# EasyEDA schematic SCH_Motor-Driver-Pcb_2024-06-14.json
TITLE: Sheet_1; REV: 1.0; Date: 2024-01-08; Sheet: 1/1; Drawn By: ee22b045; Company: Your Company
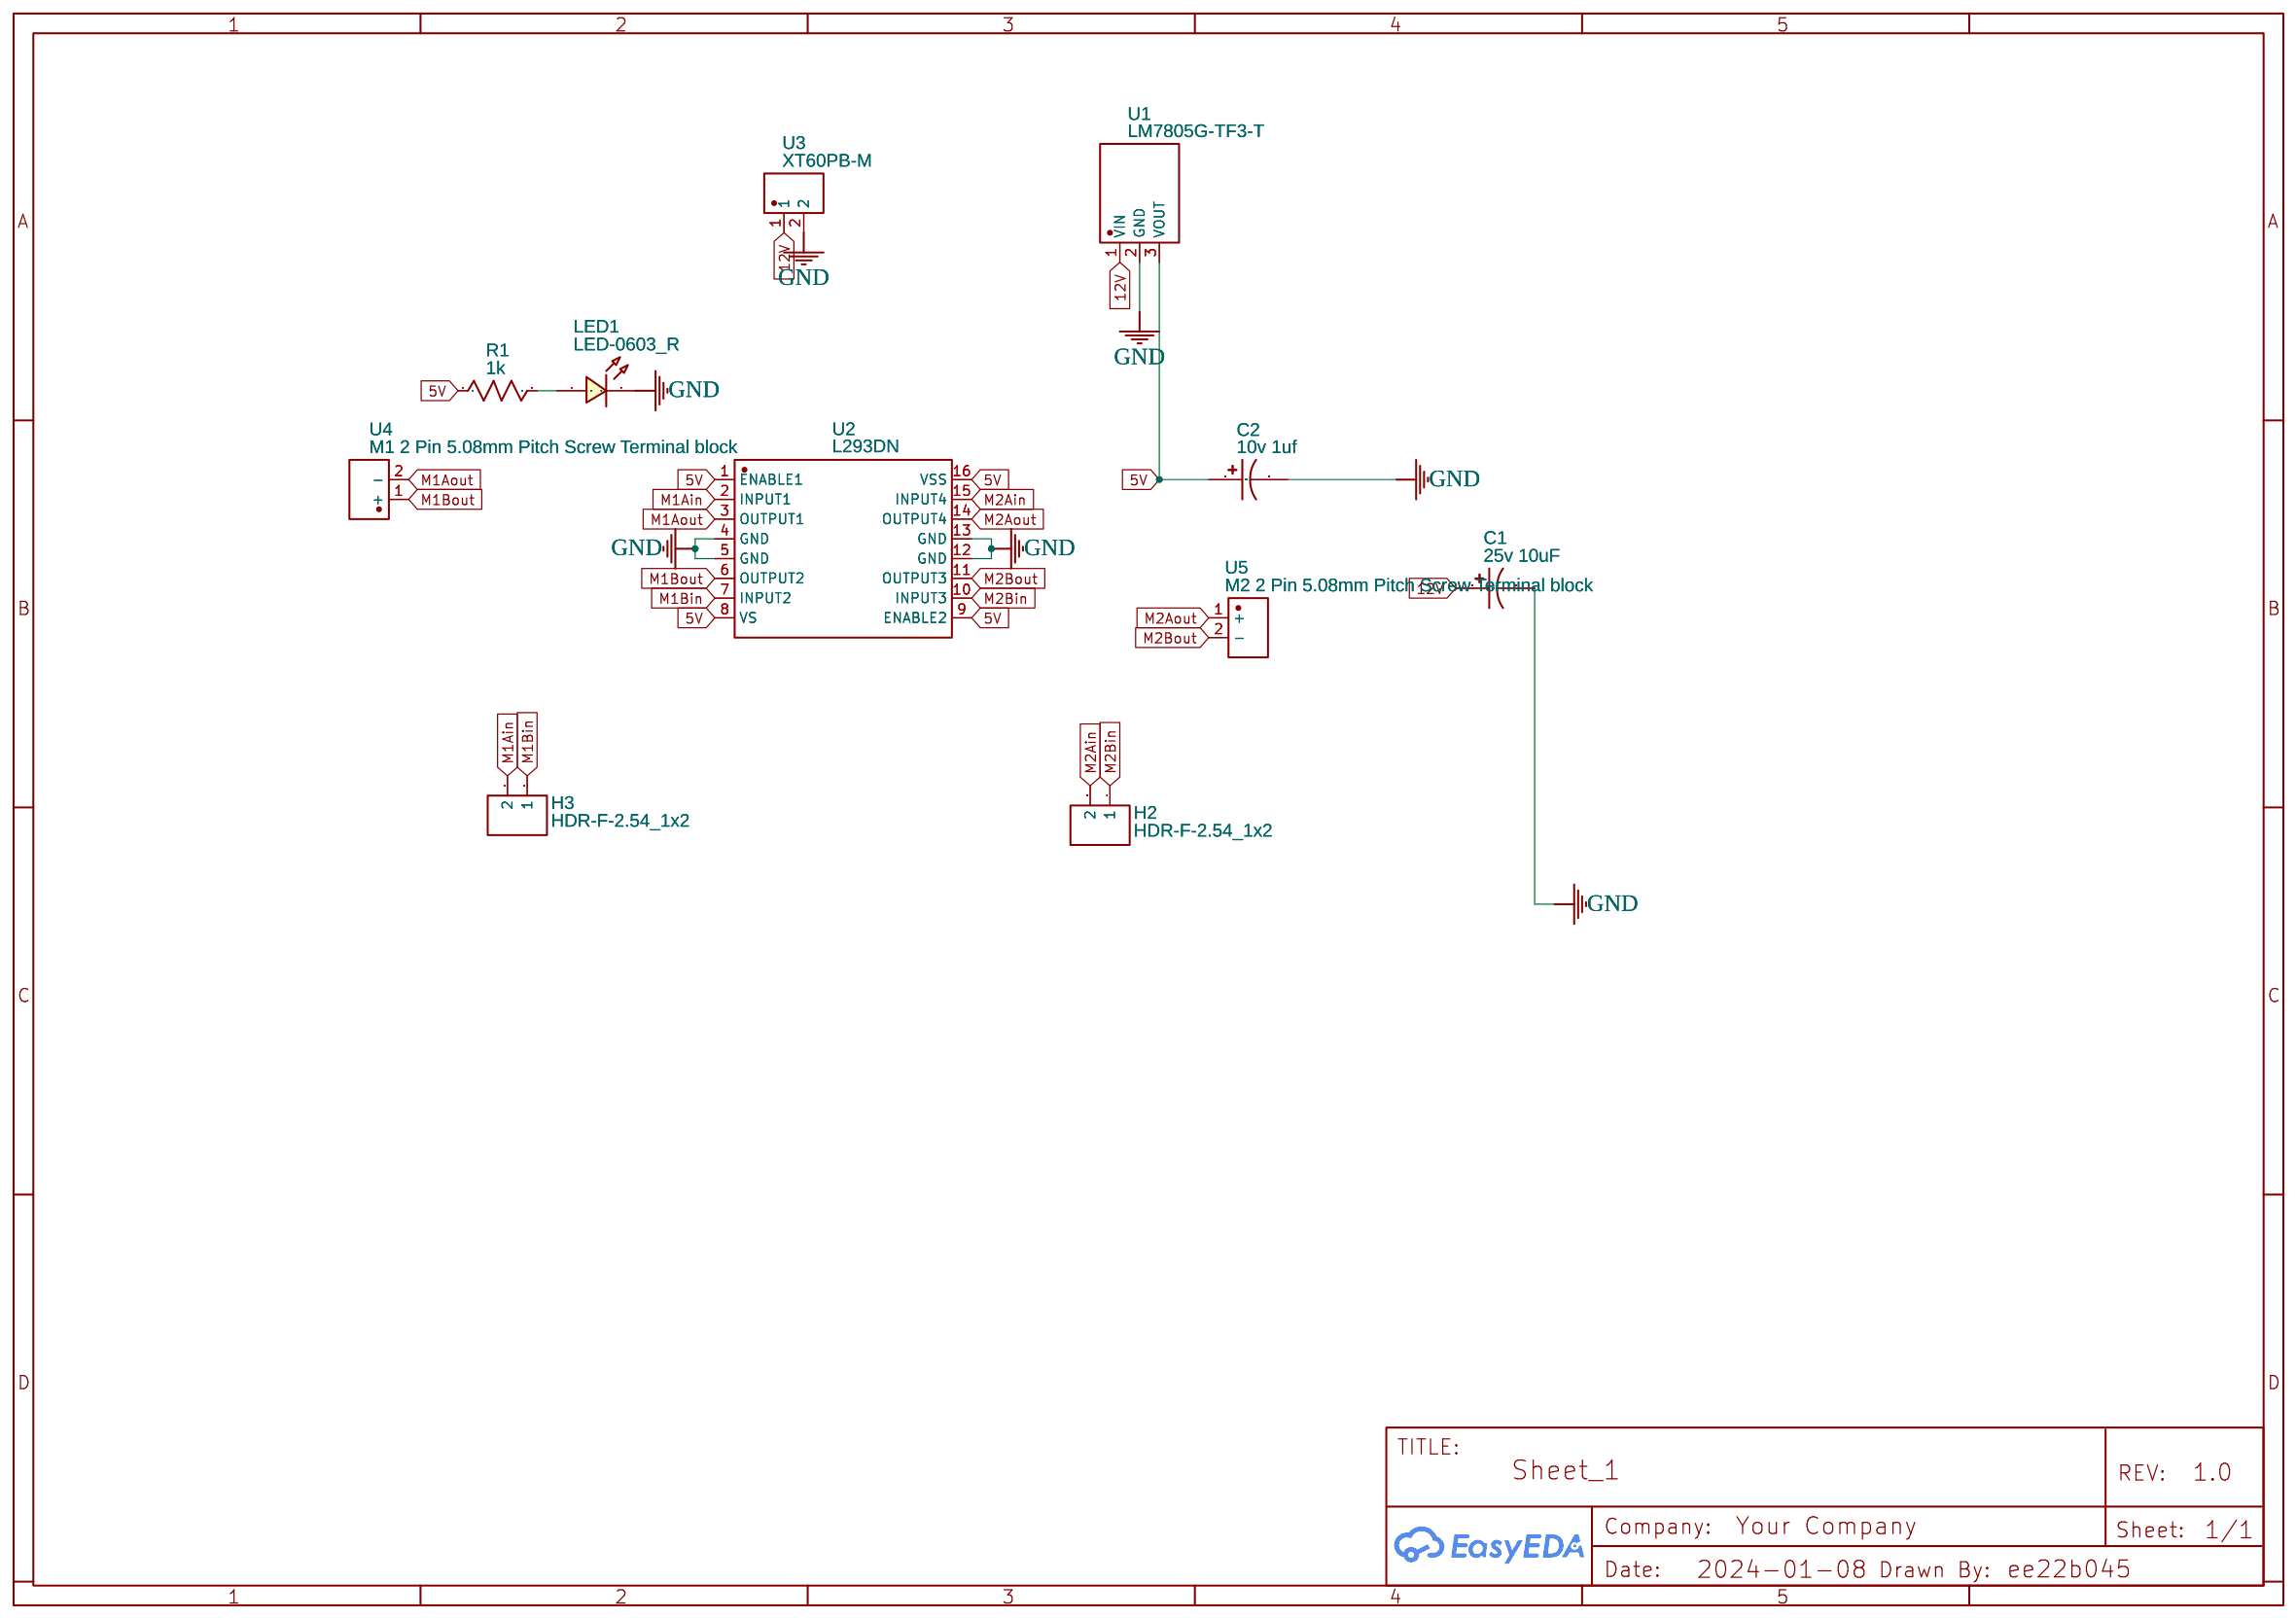
[diagram p0: schematic sheet]

## Parts
C1  25v 10uF  [CASE-A_3216]
C2  10v 1uf  [CASE-A_3216]
H2  HDR-F-2.54_1x2  [HDR-F-2.54_1X2]
H3  HDR-F-2.54_1x2  [HDR-F-2.54_1X2]
LED1  LED-0603_R  [LED0603_RED]
R1  1k  [R0603]
U1  LM7805G-TF3-T  [TO-220F-3_L10.2-W4.7-P2.54-L]
U2  L293DN  [DIP-16_L19.2-W6.6-P2.54-LS7.6-BL]
U3  XT60PB-M  [CONN-TH_XT60PB-M]
U4  M1 2 Pin 5.08mm Pitch Screw Terminal block  [2 PIN 5.08MM PITCH SCREW NEW]
U5  M2 2 Pin 5.08mm Pitch Screw Terminal block  [2 PIN 5.08MM PITCH SCREW NEW]

## Library data of the parts
C1 C2 = C_Tan_SMD_A_US: Contributor: LCEDA_Lib
H2 H3 = HDR-F-2.54_1x2: Supplier Part: C49661; Supplier: LCSC; Contributor: LCEDA_Lib
LED1 = LED-0603_R: Manufacturer: EVERLIGHT(台湾亿光); Manufacturer Part: 19-217/R6C-AL1M2VY/3T; Supplier Part: C72044; Supplier: LCSC; Contributor: LCEDA_01
R1 = R_0603_US: Contributor: LCEDA_Lib
U1 = LM7805G-TF3-T: Contributor: LCSC; Supplier: LCSC; Supplier Part: C213490; Manufacturer: UTC(友顺); JLCPCB Part Class: Extended Part
U2 = L293DN: Contributor: LCSC; Supplier: LCSC; Supplier Part: C434590; Manufacturer: HGSEMI; JLCPCB Part Class: Extended Part
U3 = XT60PB-M: Contributor: lcsc; Supplier: LCSC; Supplier Part: C9900017179; Manufacturer: null; JLCPCB Part Class: Extended Part
U4 U5 = 2 Pin 5.08mm Pitch Screw Terminal block: Contributor: kavishbalaji

## Nets
5V: C2.1 R1.1 U1.3(VOUT) U2.1(ENABLE1) U2.8(VS) U2.9(ENABLE2) U2.16(VSS)
12V: C1.1 U1.1(VIN) U3.1
GND: C1.2 C2.2 LED1.2 U1.2(GND) U2.4(GND) U2.5(GND) U2.12(GND) U2.13(GND) U3.2
M1Ain: H3.2 U2.2(INPUT1)
M1Aout: U2.3(OUTPUT1) U4.2(-)
M1Bin: H3.1 U2.7(INPUT2)
M1Bout: U2.6(OUTPUT2) U4.1(+)
M2Ain: H2.2 U2.15(INPUT4)
M2Aout: U2.14(OUTPUT4) U5.1(+)
M2Bin: H2.1 U2.10(INPUT3)
M2Bout: U2.11(OUTPUT3) U5.2(-)
Net-(LED1-1): LED1.1 R1.2
